# Altium schematic sheet Master MicroController Port L.SchDoc: Master Micro Controller Port L Pin Out
size A4; DocumentNumber: 26; SheetNumber: 26; SheetTotal: 54
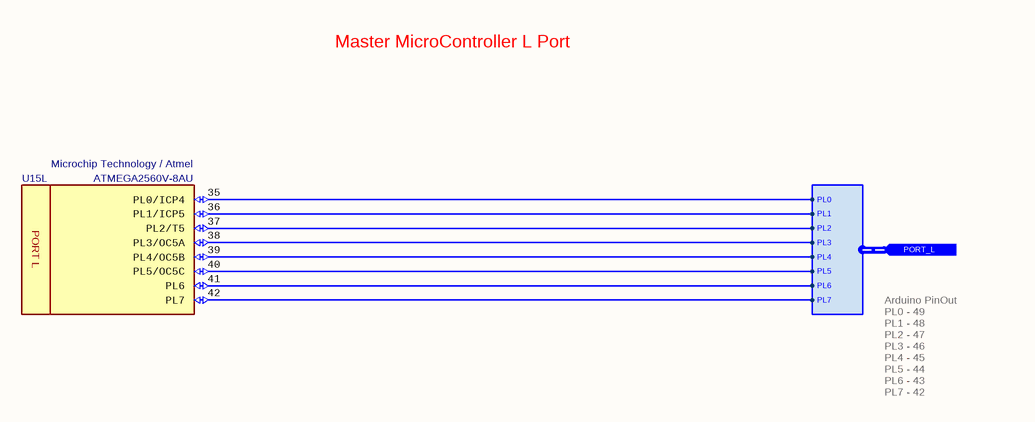
[diagram p0: Master MicroController Port L.SchDoc]

## Parts
U15  Manufacturer Part Number: ATMEGA2560V-8AU  Manufacturer Name: Microchip Technology / Atmel  [TQFP100]  (hidden comment: 8-bit MicroController)  (part L of 15)

## Ports
PORT_L (in, harness PORT_L)

## Harnesses
PORT_L: PL0, PL1, PL2, PL3, PL4, PL5, PL7, PL6

## Nets
NetU15_35: U15.35(PL0/ICP4) ; port PORT_L.PL0
NetU15_36: U15.36(PL1/ICP5) ; port PORT_L.PL1
NetU15_37: U15.37(PL2/T5) ; port PORT_L.PL2
NetU15_38: U15.38(PL3/OC5A) ; port PORT_L.PL3
NetU15_39: U15.39(PL4/OC5B) ; port PORT_L.PL4
NetU15_40: U15.40(PL5/OC5C) ; port PORT_L.PL5
NetU15_41: U15.41(PL6) ; port PORT_L.PL6
NetU15_42: U15.42(PL7) ; port PORT_L.PL7

## Notes on the sheet
- Master MicroController L Port
- Arduino PinOut
  PL0 - 49
  PL1 - 48
  PL2 - 47
  PL3 - 46
  PL4 - 45
  PL5 - 44
  PL6 - 43
  PL7 - 42
- Engineer
- All Rights are reserved to Customer and Engineer. [2021]
- Size:
- Date:
- A4
- Project :
- Time:
- Sheet
- of
- Customer
- Product ID
- Module ID
- Version
- File:
- Revision
- (in symbol IC - ATMEGA2560V-8AU, part L) PORT L

## Library data of the parts
U15 = IC - ATMEGA2560V-8AU: 8-bit Microcontrollers - MCU 256kB Flash 4kB EEPROM 86 I/O Pins; Supply Voltage - Min: 2V7; Supply Voltage - Max: 5.5V; Height: 1mm; ComponentLink1Description: DataSheet; ComponentLink1URL: https://eu.mouser.com/datasheet/2/268/Atmel-2549-8-bit-AVR-Microcontroller-ATmega640-128-1315286.pdf; ROHS: Yes; Minimum Operating Temperature: -40; Maximum Operating Temperature: +85; ComponentLink2Description: Mouser; ComponentLink2URL: https://eu.mouser.com/ProductDetail/Microchip-Technology-Atmel/ATMEGA2560V-8AU?qs=sGAEpiMZZMutXGli8Ay4kKlCYcvZUWqJYdtgGFyqFT8%3D; Supplier 1: Digi-Key; Supplier 2: Newark; Supplier 3: Avnet; Supplier 4: RSComponents; Supplier 5: RSComponents; Supplier Part Number 1: ATMEGA2560V-8AU-ND; Supplier Part Number 2: 68T2784; Supplier Part Number 3: 68T2784; Supplier Part Number 4: 1278284P; Supplier Part Number 5: 1278284; Case: TQFP-100; Supplier 6: Mouser; Supplier 7: Future Electronics; Supplier 8: Avnet; Supplier 9: Arrow Electronics; Supplier 10: Farnell; Supplier 11: Allied Electronics; Supplier 12: Future Electronics; Supplier 13: RSComponents; Supplier 14: RSComponents; Supplier 15: RSComponents; Supplier Part Number 6: 556-ATMEGA2560V8AU; Supplier Part Number 7: 4038198; Supplier Part Number 8: ATMEGA2560V-8AU; Supplier Part Number 9: ATMEGA2560V-8AU; Supplier Part Number 10: 1288331; Supplier Part Number 11: 70124009; Supplier Part Number 12: ATMEGA2560V-8AU-TRAY; Supplier Part Number 13: 6963424; Supplier Part Number 14: 6963424P; Supplier Part Number 15: 9220809